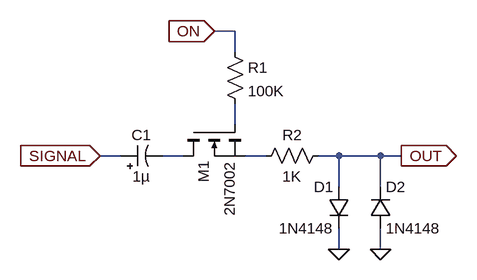
[diagram p0: schematic line_driver.asc]
line_driver.asc, the LTspice schematic file:
Version 4
SHEET 1 880 680
WIRE -16 -80 -48 -80
WIRE -16 -48 -16 -80
WIRE -16 64 -16 32
WIRE -192 112 -224 112
WIRE -96 112 -128 112
WIRE 32 112 0 112
WIRE 144 112 112 112
WIRE 208 112 144 112
WIRE 240 112 208 112
WIRE 144 160 144 112
WIRE 208 160 208 112
WIRE 144 256 144 224
WIRE 208 256 208 224
FLAG 144 256 0
FLAG 208 256 0
FLAG 240 112 OUT
IOPIN 240 112 Out
FLAG -224 112 SIGNAL
IOPIN -224 112 In
FLAG -48 -80 ON
IOPIN -48 -80 In
SYMBOL res 128 96 R90
WINDOW 0 0 56 VBottom 2
WINDOW 3 32 56 VTop 2
SYMATTR InstName R2
SYMATTR Value 1K
SYMBOL diode 160 160 M0
SYMATTR InstName D1
SYMATTR Value 1N4148
SYMBOL diode 192 224 M180
WINDOW 0 24 64 Left 2
WINDOW 3 24 0 Left 2
SYMATTR InstName D2
SYMATTR Value 1N4148
SYMBOL polcap -192 128 R270
WINDOW 0 32 32 VTop 2
WINDOW 3 0 32 VBottom 2
SYMATTR InstName C1
SYMATTR Value 1µ
SYMBOL res -32 -64 R0
SYMATTR InstName R1
SYMATTR Value 100K
SYMBOL nmos -96 64 M90
SYMATTR InstName M1
SYMATTR Value 2N7002

The netlist it stands for:
* line_driver.asc
R2 OUT N003 1K
D1 OUT 0 1N4148
D2 0 OUT 1N4148
C1 SIGNAL N002 1µ
R1 ON N001 100K
M1 N002 N001 N003 N003 2N7002
.model D D
.lib standard.dio
.model NMOS NMOS
.model PMOS PMOS
.lib standard.mos
.backanno
.end